# EasyEDA Pro project wifi tx.eprj

# Schematic Schematic1
Board Name: Board1; Create Date: 2025-08-08; Page Name: P1; Project Name: wifi tx; Schematic Name: Schematic1; Update Date: 2025-08-09; Company: EasyEDA.com; Page Size: A4; Version: V1.0
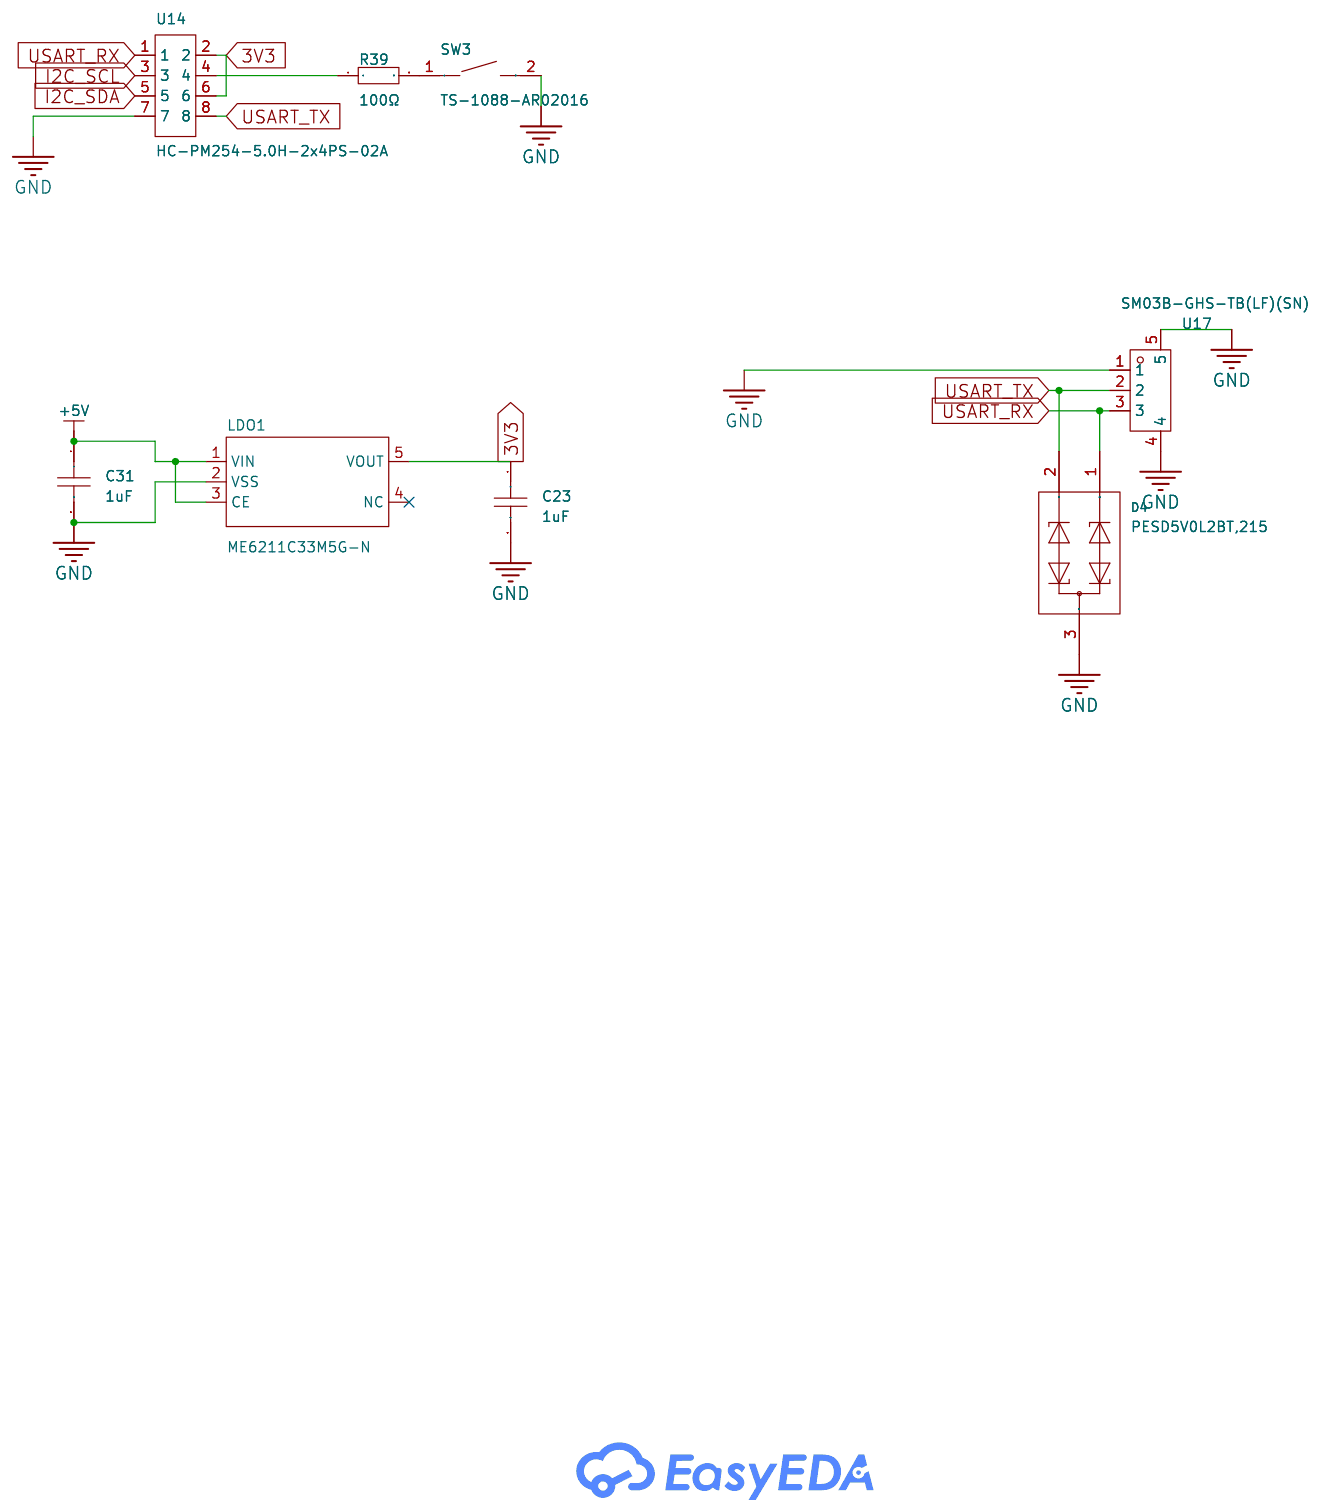
[diagram p0: schematic sheet]

## Parts
C23  1uF  [C0603]
C31  1uF  [C0603]
D4  PESD5V0L2BT,215  [SOT-23-3_L2.9-W1.3-P1.90-LS2.4-BR]
LDO1  ME6211C33M5G-N  [SOT-23-5_L3.0-W1.7-P0.95-LS2.8-BL]
R39  100Ω  [R0603]
SW3  TS-1088-AR02016  [SW-SMD_L3.9-W3.0-P4.45]
U14  HC-PM254-5.0H-2x4PS-02A  [HDR-SMD_8P-P2.54-V-F-R2-C4-S7.2-2]
U17  SM03B-GHS-TB(LF)(SN)  [CONN-TH_SM03B-GHS-TB-LF-SN]

## Library data of the parts
C23 C31 = CC0603KRX7R9BB105: Capacitance: Tolerance:±10% Tolerance:±10% Voltage Rated: Temperature Coefficient:; LCSC Part Name: 1uF ±10% 50V; Supplier Part: C559769; Manufacturer: YAGEO(国巨); Supplier Footprint: 0603; JLCPCB Part Class: Extended Part; Datasheet: https://atta.szlcsc.com/upload/public/pdf/source/20181031/C325451_C7CF01155AE3010E0D610C52F5FE7D31.pdf; Supplier: LCSC; Tolerance: ±10%
D4 = PESD5V0L2BT,215: Maximum Clamping Voltage:28V Breakdown Voltage:7V Number of Lines:双路 Type:ESD; Supplier Part: C12324; Manufacturer: Nexperia(安世); Supplier Footprint: SOT-23; JLCPCB Part Class: Extended Part; Datasheet: https://atta.szlcsc.com/upload/public/pdf/source/20150713/1457707329955.pdf; Supplier: LCSC; Maximum Clamping Voltage: 28V; Breakdown Voltage: 7V; Number of Lines: 双路; Type: ESD
LDO1 = ME6211C33M5G-N: Output Type:Fixed Voltage - Supply:6V Output Voltage:3.3V Output Voltage:3.3V Output Current:500mA Power Supply Rejection Ratio (PSRR):70dB@(1kHz) Voltage Dropout:120mV@(100mA) standby current:60uA Noise:50uVrms Features:Over Current Protection；Enable；Sho; LCSC Part Name: 输入6V 输出3.3V 500mA; Supplier Part: C82942; Manufacturer: MICRONE(南京微盟); Supplier Footprint: SOT-23-5; JLCPCB Part Class: Extended Part; Datasheet: https://atta.szlcsc.com/upload/public/pdf/source/20170918/C82942_1505727073070976520.pdf; Supplier: LCSC; Output Type: Fixed; Voltage - Supply: 6V; Output Voltage: 3.3V; Output Current: 500mA; Power Supply Rejection Ratio (PSRR): 70dB@(1kHz); Voltage Dropout: 120mV@(100mA); standby current: 60uA; Noise: 50uVrms; Features: Over Current Protection；Enable；Short Circuit Protection; Operating Temperature: -40℃~+150℃; Output Configuration: Positive; Number of Outputs: 1
R39 = RC0603FR-07100RL: Type:Thick Film Resistors Resistance: Tolerance:±1% Tolerance:±1% Power(Watts): Overload Voltage (Max): Temperature Coefficient:±100ppm/℃ Temperature Coefficient:±100ppm/℃ Operating Temperature Range:-55℃~+155℃ Operating Temperature Range:-55℃~+155℃; LCSC Part Name: 厚膜电阻 100Ω ±1% 100mW; Supplier Part: C105588; Manufacturer: YAGEO(国巨); Supplier Footprint: 0603; JLCPCB Part Class: Extended Part; Datasheet: https://atta.szlcsc.com/upload/public/pdf/source/20180316/70C0E2BDAE7FCC62C531A5A58D202EE1.pdf; Supplier: LCSC; Type: Thick Film Resistors; Tolerance: ±1%; Temperature Coefficient: ±100ppm/℃; Operating Temperature Range: -55℃~+155℃
SW3 = TS-1088-AR02016: Circuit:SPST Actuator Style:Round Button Operating Force:160gf Mounting Style:Brick nogging Switch Length:4mm Switch Width:3mm Switch Height:2mm Strike Gundam:不带 Contact Current:50mA Voltage Rating (DC):12V Insulation Resistance:100MΩ Actuator/Cap Color:B; LCSC Part Name: 4*3*2mm 立贴 轻触开关; Supplier Part: C720477; Manufacturer: XUNPU(讯普); Supplier Footprint: SMD; JLCPCB Part Class: Basic Part; Datasheet: https://atta.szlcsc.com/upload/public/pdf/source/20200810/C720475_60D09DD6C54279ADDB2DC25100F1CC11.pdf; Supplier: LCSC; Circuit: SPST; Actuator Style: Round Button; Operating Force: 160gf; Mounting Style: Brick nogging; Switch Length: 4mm; Switch Width: 3mm; Switch Height: 2mm; Strike Gundam: 不带; Contact Current: 50mA; Voltage Rating (DC): 12V; Insulation Resistance: 100MΩ; Actuator/Cap Color: Black; Pin Style: SMDSplicing; Mechanical Life: 10万次; Operating Temperature: -30℃~+80℃
U14 = HC-PM254-5.0H-2x4PS-02A: Holes Structure:2x4P Pitch:2.54mm Row Spacing:2.54mm Circular Hole / Square Hole:Square Hole Mounting Type:Standing paste Number of Rows:Double Row Number of Positions:8P Current Rating:3A Voltage Rating (Max):- Holes Direction:Top Insulation Height:5mm C; LCSC Part Name: 间距2.54mm 2x4Pin 立贴 PW7.4 H5.0; Supplier Part: C42163132; Manufacturer: HC(虹成电子); Supplier Footprint: SMD,P=2.54mm; JLCPCB Part Class: Extended Part; Datasheet: https://atta.szlcsc.com/upload/public/pdf/source/20250106/ED77D614D8CCA6501703FB1B7CCAFA65.pdf; Supplier: LCSC; Holes Structure: 2x4P; Pitch: 2.54mm; Row Spacing: 2.54mm; Circular Hole / Square Hole: Square Hole; Mounting Type: Standing paste; Number of Rows: Double Row; Number of Positions: 8P; Current Rating: 3A; Holes Direction: Top; Insulation Height: 5mm; Contact Material: Brass; Contact Plating: Gold; Operating Temperature: -40℃~+105℃
U17 = SM03B-GHS-TB(LF)(SN): Pins Structure:1x3P Pitch:1.25mm Mounting Style:Horizontal attachment Reference Series:GH Number of Pins:3P Number of Rows:1 Number of PINs Per Row:3 Row Spacing:- Current Rating (Max):1A Contact Material:Phosphor Bronze Contact Plating:Tin Operating Temp; LCSC Part Name: 1x3P 间距:1.25mm 卧贴 系列:GH; Supplier Part: C514175; Manufacturer: JST; Supplier Footprint: SMD,P=1.25mm,卧贴; JLCPCB Part Class: Extended Part; Datasheet: https://atta.szlcsc.com/upload/public/pdf/source/20200416/C514175_6D761544780BFF1FCAB26BE8A747A99F.pdf; Supplier: LCSC; Pins Structure: 1x3P; Pitch: 1.25mm; Mounting Style: Horizontal attachment; Reference Series: GH; Number of Pins: 3P; Number of Rows: 1; Number of PINs Per Row: 3; Current Rating (Max): 1A; Contact Material: Phosphor Bronze; Contact Plating: Tin; Operating Temperature Range: -25℃~+85℃; Rated Voltage (Max): 50V; Plastic Material: PA9T; Flame Retardant Rating: UL94V-0; Supplementary Features: Auxiliary soldering legs; Colour: White; Z-Height of the Board: 4.25mm; X-Length of Bottom Edge on Board (Spacing Line): 7mm; Y-Width of Bottom Edge on Board: 4.13mm

## Nets
3V3: C23.1 LDO1.5(VOUT) U14.2 U14.6
+5V: C31.1 LDO1.1(VIN) LDO1.3(CE)
GND: C23.2 C31.2 D4.3(DC) LDO1.2(VSS) SW3.2 U14.7 U17.1 U17.4 U17.5
I2C_SCL: U14.3
I2C_SDA: U14.5
USART_RX: D4.1(C1) U14.1 U17.3
USART_TX: D4.2(C2) U14.8 U17.2
Net-(R39-1): R39.1 U14.4
Net-(R39-2): R39.2 SW3.1

Not connected (* = marked no-connect by the designer): LDO1 4(NC)*
